# Altium schematic sheet Buzzer.SchDoc
size 209 x 148 mm
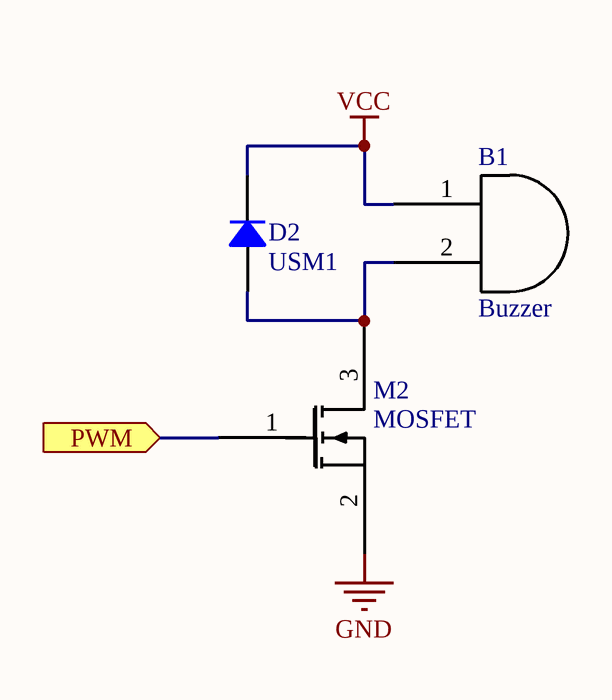
[diagram p0: Buzzer.SchDoc]

## Parts
B1  Buzzer  [BUZZER-CSPT12A]
D2  USM1  [DO-214AC SMA]
M2  MOSFET  [SOT-23]

## Ports
PWM (in)

## Nets
GND: M2.2
VCC: B1.1 D2.2
PWM: M2.1 ; port PWM
NetB1_2: B1.2 D2.1 M2.3

## Library data of the parts
D2 = US1M (SMD SMA): Diode Standard 1000V 1A Surface Mount SMA; PartNumber: US1M-13-F
M2 = 2N7002A